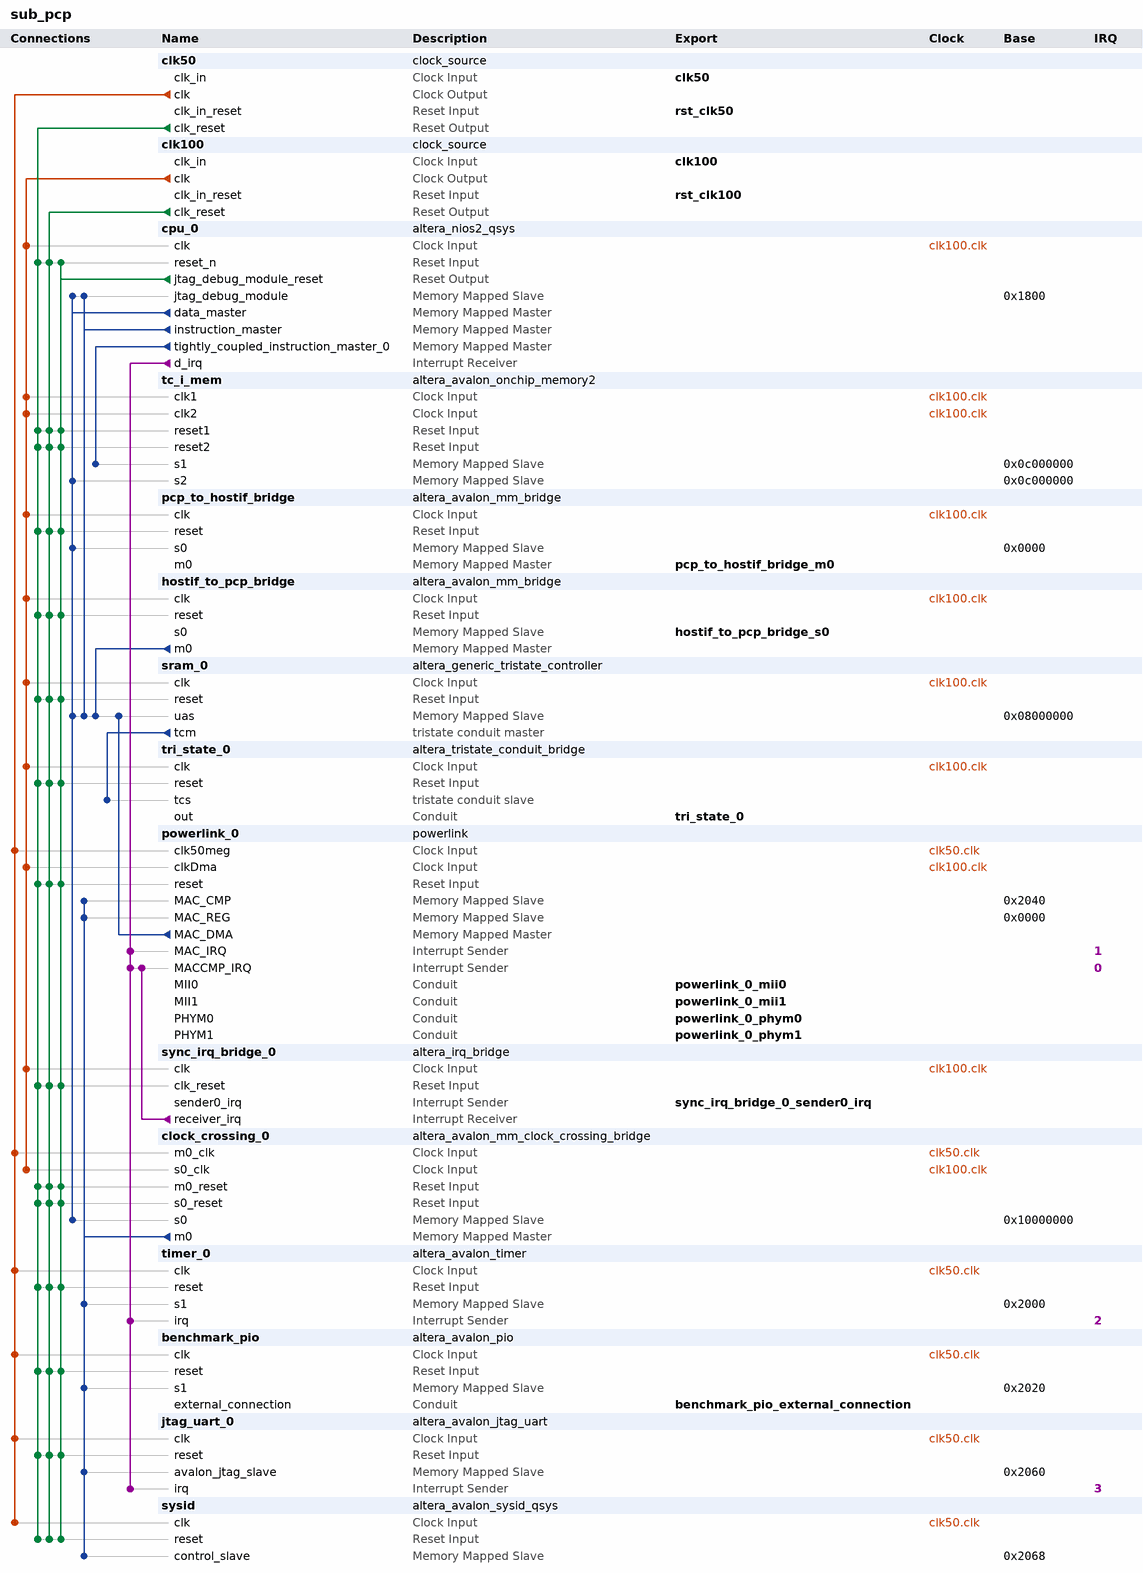
[diagram p0: system contents]
# Platform Designer (Qsys) system sub_pcp, Cyclone IV E EP4CE115F29C7
# Parameters at their usual value, and those the tool derives, are not listed.
package require -exact qsys 12.1
create_system sub_pcp
set_project_property DEVICE_FAMILY {Cyclone IV E}
set_project_property DEVICE EP4CE115F29C7

add_instance clk50 clock_source 12.1
set_instance_parameter_value clk50 clockFrequency 50000000

add_instance clk100 clock_source 12.1
set_instance_parameter_value clk100 clockFrequency 100000000

add_instance cpu_0 altera_nios2_qsys 12.1
set_instance_parameter_value cpu_0 muldiv_divider true
set_instance_parameter_value cpu_0 resetSlave tc_i_mem.s1
set_instance_parameter_value cpu_0 exceptionSlave tc_i_mem.s1
set_instance_parameter_value cpu_0 breakSlave cpu_0.jtag_debug_module
set_instance_parameter_value cpu_0 impl Fast
set_instance_parameter_value cpu_0 icache_size 4096
set_instance_parameter_value cpu_0 icache_numTCIM 1
set_instance_parameter_value cpu_0 dcache_size 4096

add_instance tc_i_mem altera_avalon_onchip_memory2 12.1
set_instance_parameter_value tc_i_mem dataWidth 32
set_instance_parameter_value tc_i_mem dualPort true
set_instance_parameter_value tc_i_mem initMemContent true
set_instance_parameter_value tc_i_mem initializationFileName tc_i_mem
set_instance_parameter_value tc_i_mem memorySize 20480

add_instance pcp_to_hostif_bridge altera_avalon_mm_bridge 12.1
set_instance_parameter_value pcp_to_hostif_bridge DATA_WIDTH 32
set_instance_parameter_value pcp_to_hostif_bridge ADDRESS_WIDTH 11
set_instance_parameter_value pcp_to_hostif_bridge ADDRESS_UNITS SYMBOLS
set_instance_parameter_value pcp_to_hostif_bridge MAX_PENDING_RESPONSES 1
set_instance_parameter_value pcp_to_hostif_bridge PIPELINE_COMMAND 0
set_instance_parameter_value pcp_to_hostif_bridge PIPELINE_RESPONSE 0

add_instance hostif_to_pcp_bridge altera_avalon_mm_bridge 12.1
set_instance_parameter_value hostif_to_pcp_bridge DATA_WIDTH 32
set_instance_parameter_value hostif_to_pcp_bridge ADDRESS_WIDTH 30
set_instance_parameter_value hostif_to_pcp_bridge ADDRESS_UNITS SYMBOLS
set_instance_parameter_value hostif_to_pcp_bridge MAX_PENDING_RESPONSES 1
set_instance_parameter_value hostif_to_pcp_bridge PIPELINE_COMMAND 0
set_instance_parameter_value hostif_to_pcp_bridge PIPELINE_RESPONSE 0

add_instance sram_0 altera_generic_tristate_controller 12.1
set_instance_parameter_value sram_0 TCM_ADDRESS_W 21
set_instance_parameter_value sram_0 TCM_DATA_W 16
set_instance_parameter_value sram_0 TCM_BYTEENABLE_W 2
set_instance_parameter_value sram_0 TCM_READ_WAIT 1
set_instance_parameter_value sram_0 TCM_WRITE_WAIT 0
set_instance_parameter_value sram_0 TCM_SETUP_WAIT 0
set_instance_parameter_value sram_0 TCM_DATA_HOLD 0
set_instance_parameter_value sram_0 TCM_MAX_PENDING_READ_TRANSACTIONS 1
set_instance_parameter_value sram_0 TCM_TURNAROUND_TIME 1
set_instance_parameter_value sram_0 TCM_TIMING_UNITS 1
set_instance_parameter_value sram_0 TCM_READLATENCY 2
set_instance_parameter_value sram_0 TCM_SYMBOLS_PER_WORD 2
set_instance_parameter_value sram_0 USE_READ 1
set_instance_parameter_value sram_0 USE_BEGINTRANSFER 0
set_instance_parameter_value sram_0 USE_BYTEENABLE 1
set_instance_parameter_value sram_0 USE_OUTPUTENABLE 0
set_instance_parameter_value sram_0 ACTIVE_LOW_READ 1
set_instance_parameter_value sram_0 ACTIVE_LOW_BYTEENABLE 1
set_instance_parameter_value sram_0 ACTIVE_LOW_OUTPUTENABLE 0
set_instance_parameter_value sram_0 ACTIVE_LOW_BEGINTRANSFER 0
set_instance_parameter_value sram_0 CHIPSELECT_THROUGH_READLATENCY 0
set_instance_parameter_value sram_0 MODULE_ASSIGNMENT_KEYS embeddedsw.CMacro.SIZE
set_instance_parameter_value sram_0 MODULE_ASSIGNMENT_VALUES 2097152

add_instance tri_state_0 altera_tristate_conduit_bridge 12.1

add_instance powerlink_0 powerlink 0.2.9
set_instance_parameter_value powerlink_0 pcpSysId 1
set_instance_parameter_value powerlink_0 expertMode true
set_instance_parameter_value powerlink_0 clkRateEth 0
set_instance_parameter_value powerlink_0 clkRate50 50000000
set_instance_parameter_value powerlink_0 clkRatePcp 0
set_instance_parameter_value powerlink_0 configPowerlink {openMAC only}
set_instance_parameter_value powerlink_0 configApInterface Avalon
set_instance_parameter_value powerlink_0 configApParallelInterface 8bit
set_instance_parameter_value powerlink_0 configApParSigs {High Active}
set_instance_parameter_value powerlink_0 configApParOutSigs {High Active}
set_instance_parameter_value powerlink_0 configApEndian Little
set_instance_parameter_value powerlink_0 configApSpi_CPOL 0
set_instance_parameter_value powerlink_0 configApSpi_CPHA 0
set_instance_parameter_value powerlink_0 configApSpi_IRQ {High Active}
set_instance_parameter_value powerlink_0 rpdoNum 3
set_instance_parameter_value powerlink_0 rpdo0size 1
set_instance_parameter_value powerlink_0 tpdoNum 1
set_instance_parameter_value powerlink_0 tpdo0size 1
set_instance_parameter_value powerlink_0 genLedGadget true
set_instance_parameter_value powerlink_0 genEvent true
set_instance_parameter_value powerlink_0 asyncBuf1Size 1514
set_instance_parameter_value powerlink_0 asyncBuf2Size 1514
set_instance_parameter_value powerlink_0 phyIF MII
set_instance_parameter_value powerlink_0 packetLoc {TX and RX over Avalon Master}
set_instance_parameter_value powerlink_0 validSet 1
set_instance_parameter_value powerlink_0 macTxBuf 7000
set_instance_parameter_value powerlink_0 macRxBuf 16
set_instance_parameter_value powerlink_0 hwSupportSyncIrq false
set_instance_parameter_value powerlink_0 mac2phys true
set_instance_parameter_value powerlink_0 macGen2ndSmi true
set_instance_parameter_value powerlink_0 macTxBurstSize 16
set_instance_parameter_value powerlink_0 macRxBurstSize 16
set_instance_parameter_value powerlink_0 enDmaObserver true

add_instance sync_irq_bridge_0 altera_irq_bridge 12.1
set_instance_parameter_value sync_irq_bridge_0 IRQ_WIDTH 1

add_instance clock_crossing_0 altera_avalon_mm_clock_crossing_bridge 12.1
set_instance_parameter_value clock_crossing_0 DATA_WIDTH 32
set_instance_parameter_value clock_crossing_0 ADDRESS_WIDTH 14
set_instance_parameter_value clock_crossing_0 MAX_BURST_SIZE 1
set_instance_parameter_value clock_crossing_0 COMMAND_FIFO_DEPTH 4
set_instance_parameter_value clock_crossing_0 RESPONSE_FIFO_DEPTH 4
set_instance_parameter_value clock_crossing_0 MASTER_SYNC_DEPTH 2
set_instance_parameter_value clock_crossing_0 SLAVE_SYNC_DEPTH 2

add_instance timer_0 altera_avalon_timer 12.1
set_instance_parameter_value timer_0 alwaysRun true
set_instance_parameter_value timer_0 fixedPeriod true
set_instance_parameter_value timer_0 period 1
set_instance_parameter_value timer_0 periodUnits MSEC
set_instance_parameter_value timer_0 snapshot false
set_instance_parameter_value timer_0 timerPreset SIMPLE_PERIODIC_INTERRUPT

add_instance benchmark_pio altera_avalon_pio 12.1
set_instance_parameter_value benchmark_pio bitModifyingOutReg true
set_instance_parameter_value benchmark_pio direction Output
set_instance_parameter_value benchmark_pio width 8

add_instance jtag_uart_0 altera_avalon_jtag_uart 12.1
set_instance_parameter_value jtag_uart_0 simInteractiveOptions INTERACTIVE_ASCII_OUTPUT

add_instance sysid altera_avalon_sysid_qsys 12.1
set_instance_parameter_value sysid id 0

# connections
add_connection clk50.clk benchmark_pio.clk clock
add_connection clk50.clk clock_crossing_0.m0_clk clock
add_connection clk50.clk jtag_uart_0.clk clock
add_connection clk50.clk powerlink_0.clk50meg clock
add_connection clk50.clk sysid.clk clock
add_connection clk50.clk timer_0.clk clock
add_connection clk100.clk clock_crossing_0.s0_clk clock
add_connection clk100.clk cpu_0.clk clock
add_connection clk100.clk hostif_to_pcp_bridge.clk clock
add_connection clk100.clk pcp_to_hostif_bridge.clk clock
add_connection clk100.clk powerlink_0.clkDma clock
add_connection clk100.clk sram_0.clk clock
add_connection clk100.clk sync_irq_bridge_0.clk clock
add_connection clk100.clk tc_i_mem.clk1 clock
add_connection clk100.clk tc_i_mem.clk2 clock
add_connection clk100.clk tri_state_0.clk clock
add_connection clk50.clk_reset benchmark_pio.reset reset
add_connection clk50.clk_reset clock_crossing_0.m0_reset reset
add_connection clk50.clk_reset clock_crossing_0.s0_reset reset
add_connection clk50.clk_reset cpu_0.reset_n reset
add_connection clk50.clk_reset hostif_to_pcp_bridge.reset reset
add_connection clk50.clk_reset jtag_uart_0.reset reset
add_connection clk50.clk_reset pcp_to_hostif_bridge.reset reset
add_connection clk50.clk_reset powerlink_0.reset reset
add_connection clk50.clk_reset sram_0.reset reset
add_connection clk50.clk_reset sync_irq_bridge_0.clk_reset reset
add_connection clk50.clk_reset sysid.reset reset
add_connection clk50.clk_reset tc_i_mem.reset1 reset
add_connection clk50.clk_reset tc_i_mem.reset2 reset
add_connection clk50.clk_reset timer_0.reset reset
add_connection clk50.clk_reset tri_state_0.reset reset
add_connection clk100.clk_reset benchmark_pio.reset reset
add_connection clk100.clk_reset clock_crossing_0.m0_reset reset
add_connection clk100.clk_reset clock_crossing_0.s0_reset reset
add_connection clk100.clk_reset cpu_0.reset_n reset
add_connection clk100.clk_reset hostif_to_pcp_bridge.reset reset
add_connection clk100.clk_reset jtag_uart_0.reset reset
add_connection clk100.clk_reset pcp_to_hostif_bridge.reset reset
add_connection clk100.clk_reset powerlink_0.reset reset
add_connection clk100.clk_reset sram_0.reset reset
add_connection clk100.clk_reset sync_irq_bridge_0.clk_reset reset
add_connection clk100.clk_reset sysid.reset reset
add_connection clk100.clk_reset tc_i_mem.reset1 reset
add_connection clk100.clk_reset tc_i_mem.reset2 reset
add_connection clk100.clk_reset timer_0.reset reset
add_connection clk100.clk_reset tri_state_0.reset reset
add_connection cpu_0.jtag_debug_module_reset benchmark_pio.reset reset
add_connection cpu_0.jtag_debug_module_reset clock_crossing_0.m0_reset reset
add_connection cpu_0.jtag_debug_module_reset clock_crossing_0.s0_reset reset
add_connection cpu_0.jtag_debug_module_reset cpu_0.reset_n reset
add_connection cpu_0.jtag_debug_module_reset hostif_to_pcp_bridge.reset reset
add_connection cpu_0.jtag_debug_module_reset jtag_uart_0.reset reset
add_connection cpu_0.jtag_debug_module_reset pcp_to_hostif_bridge.reset reset
add_connection cpu_0.jtag_debug_module_reset powerlink_0.reset reset
add_connection cpu_0.jtag_debug_module_reset sram_0.reset reset
add_connection cpu_0.jtag_debug_module_reset sync_irq_bridge_0.clk_reset reset
add_connection cpu_0.jtag_debug_module_reset sysid.reset reset
add_connection cpu_0.jtag_debug_module_reset tc_i_mem.reset1 reset
add_connection cpu_0.jtag_debug_module_reset tc_i_mem.reset2 reset
add_connection cpu_0.jtag_debug_module_reset timer_0.reset reset
add_connection cpu_0.jtag_debug_module_reset tri_state_0.reset reset
add_connection clock_crossing_0.m0 benchmark_pio.s1 avalon
set_connection_parameter_value clock_crossing_0.m0/benchmark_pio.s1 baseAddress 0x2020
add_connection clock_crossing_0.m0 jtag_uart_0.avalon_jtag_slave avalon
set_connection_parameter_value clock_crossing_0.m0/jtag_uart_0.avalon_jtag_slave baseAddress 0x2060
add_connection clock_crossing_0.m0 powerlink_0.MAC_CMP avalon
set_connection_parameter_value clock_crossing_0.m0/powerlink_0.MAC_CMP baseAddress 0x2040
add_connection clock_crossing_0.m0 powerlink_0.MAC_REG avalon
set_connection_parameter_value clock_crossing_0.m0/powerlink_0.MAC_REG baseAddress 0x0000
add_connection clock_crossing_0.m0 sysid.control_slave avalon
set_connection_parameter_value clock_crossing_0.m0/sysid.control_slave baseAddress 0x2068
add_connection clock_crossing_0.m0 timer_0.s1 avalon
set_connection_parameter_value clock_crossing_0.m0/timer_0.s1 baseAddress 0x2000
add_connection cpu_0.data_master clock_crossing_0.s0 avalon
set_connection_parameter_value cpu_0.data_master/clock_crossing_0.s0 baseAddress 0x10000000
add_connection cpu_0.data_master cpu_0.jtag_debug_module avalon
set_connection_parameter_value cpu_0.data_master/cpu_0.jtag_debug_module baseAddress 0x1800
add_connection cpu_0.data_master pcp_to_hostif_bridge.s0 avalon
set_connection_parameter_value cpu_0.data_master/pcp_to_hostif_bridge.s0 baseAddress 0x0000
add_connection cpu_0.data_master sram_0.uas avalon
set_connection_parameter_value cpu_0.data_master/sram_0.uas baseAddress 0x08000000
add_connection cpu_0.data_master tc_i_mem.s2 avalon
set_connection_parameter_value cpu_0.data_master/tc_i_mem.s2 baseAddress 0x0c000000
add_connection cpu_0.instruction_master cpu_0.jtag_debug_module avalon
set_connection_parameter_value cpu_0.instruction_master/cpu_0.jtag_debug_module baseAddress 0x1800
add_connection cpu_0.instruction_master sram_0.uas avalon
set_connection_parameter_value cpu_0.instruction_master/sram_0.uas baseAddress 0x08000000
add_connection cpu_0.tightly_coupled_instruction_master_0 tc_i_mem.s1 avalon
set_connection_parameter_value cpu_0.tightly_coupled_instruction_master_0/tc_i_mem.s1 baseAddress 0x0c000000
add_connection hostif_to_pcp_bridge.m0 sram_0.uas avalon
set_connection_parameter_value hostif_to_pcp_bridge.m0/sram_0.uas baseAddress 0x08000000
add_connection powerlink_0.MAC_DMA sram_0.uas avalon
set_connection_parameter_value powerlink_0.MAC_DMA/sram_0.uas baseAddress 0x08000000
add_connection cpu_0.d_irq jtag_uart_0.irq interrupt
set_connection_parameter_value cpu_0.d_irq/jtag_uart_0.irq irqNumber 3
add_connection cpu_0.d_irq powerlink_0.MAC_IRQ interrupt
set_connection_parameter_value cpu_0.d_irq/powerlink_0.MAC_IRQ irqNumber 1
add_connection cpu_0.d_irq powerlink_0.MACCMP_IRQ interrupt
set_connection_parameter_value cpu_0.d_irq/powerlink_0.MACCMP_IRQ irqNumber 0
add_connection cpu_0.d_irq timer_0.irq interrupt
set_connection_parameter_value cpu_0.d_irq/timer_0.irq irqNumber 2
add_connection sync_irq_bridge_0.receiver_irq powerlink_0.MACCMP_IRQ interrupt
set_connection_parameter_value sync_irq_bridge_0.receiver_irq/powerlink_0.MACCMP_IRQ irqNumber 0
add_connection sram_0.tcm tri_state_0.tcs tristate_conduit

# exported interfaces
add_interface clk50 clock sink
set_interface_property clk50 EXPORT_OF clk50.clk_in
add_interface rst_clk50 reset sink
set_interface_property rst_clk50 EXPORT_OF clk50.clk_in_reset
add_interface clk100 clock sink
set_interface_property clk100 EXPORT_OF clk100.clk_in
add_interface rst_clk100 reset sink
set_interface_property rst_clk100 EXPORT_OF clk100.clk_in_reset
add_interface tri_state_0 conduit end
set_interface_property tri_state_0 EXPORT_OF tri_state_0.out
add_interface benchmark_pio_external_connection conduit end
set_interface_property benchmark_pio_external_connection EXPORT_OF benchmark_pio.external_connection
add_interface powerlink_0_phym0 conduit end
set_interface_property powerlink_0_phym0 EXPORT_OF powerlink_0.PHYM0
add_interface powerlink_0_phym1 conduit end
set_interface_property powerlink_0_phym1 EXPORT_OF powerlink_0.PHYM1
add_interface powerlink_0_mii0 conduit end
set_interface_property powerlink_0_mii0 EXPORT_OF powerlink_0.MII0
add_interface powerlink_0_mii1 conduit end
set_interface_property powerlink_0_mii1 EXPORT_OF powerlink_0.MII1
add_interface pcp_to_hostif_bridge_m0 avalon master
set_interface_property pcp_to_hostif_bridge_m0 EXPORT_OF pcp_to_hostif_bridge.m0
add_interface hostif_to_pcp_bridge_s0 avalon slave
set_interface_property hostif_to_pcp_bridge_s0 EXPORT_OF hostif_to_pcp_bridge.s0
add_interface sync_irq_bridge_0_sender0_irq interrupt sender
set_interface_property sync_irq_bridge_0_sender0_irq EXPORT_OF sync_irq_bridge_0.sender0_irq

save_system sub_pcp.qsys
